# Altium schematic sheet ActiTouch_Transmitter_Sheet1.SchDoc
size A4; SheetNumber: 3; SheetTotal: 6
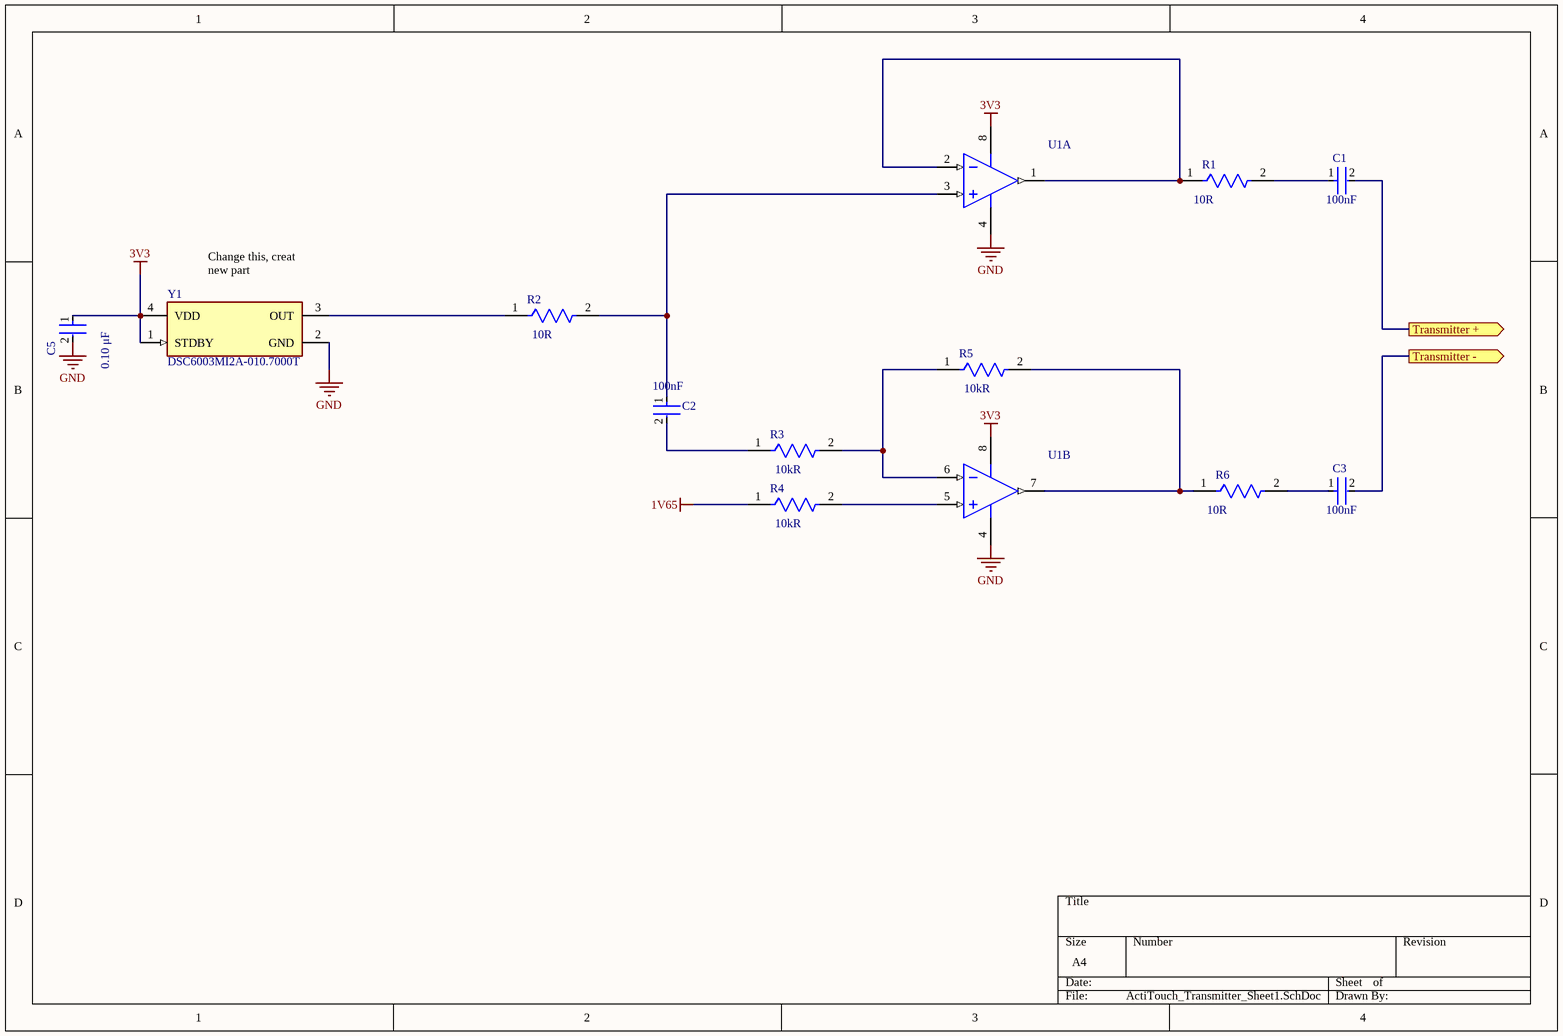
[diagram p0: ActiTouch_Transmitter_Sheet1.SchDoc]

## Parts
C1  Capacitance: 100nF  [FP-0603-L_1_6_0_1-W_0_8_0-IPC_B]  (hidden comment: EMK107B7104KAHT)
C2  Capacitance: 100nF  [FP-0603-L_1_6_0_1-W_0_8_0-IPC_B]  (hidden comment: EMK107B7104KAHT)
C3  Capacitance: 100nF  [FP-0603-L_1_6_0_1-W_0_8_0-IPC_B]  (hidden comment: EMK107B7104KAHT)
C5  value 0.10 μF  [FP-C0603C-CF-MFG]  (hidden comment: C0603C104K5RACTU)
R1  Resistance: 10R  [FP-RNCP0603-MFG]  (hidden comment: RNCP0603FTD10R0)
R2  Resistance: 10R  [FP-RNCP0603-MFG]  (hidden comment: RNCP0603FTD10R0)
R3  Resistance: 10kR  [FP-RNCP0603-MFG]  (hidden comment: RNCP0603FTD10R0)
R4  Resistance: 10kR  [FP-RNCP0603-MFG]  (hidden comment: RNCP0603FTD10R0)
R5  Resistance: 10kR  [FP-RNCP0603-MFG]  (hidden comment: RNCP0603FTD10R0)
R6  Resistance: 10R  [FP-RNCP0603-MFG]  (hidden comment: RNCP0603FTD10R0)
U1  OPA2836IDR  [D0008A_M]  (value not drawn)  (parts A,B of 2)
Y1  DSC6003MI2A-010.7000T  [FP-C04-1202-MFG]

## Ports
Transmitter + (out), Transmitter - (out)

## Nets
1V65: R4.1
3V3: C5.1 U1.8(VS+) Y1.1(STDBY) Y1.4(VDD)
GND: C5.2 U1.4(VS-) Y1.2(GND)
Transmitter +: C1.2 ; port Transmitter +
Transmitter -: C3.2 ; port Transmitter -
NetC1_1: C1.1 R1.2
NetC2_1: C2.1 R2.2 U1.3(VIN1+)
NetC2_2: C2.2 R3.1
NetC3_1: C3.1 R6.2
NetR1_1: R1.1 U1.1(VOUT1) U1.2(VIN1-)
NetR2_1: R2.1 Y1.3(OUT)
NetR3_2: R3.2 R5.1 U1.6(VIN2-)
NetR4_2: R4.2 U1.5(VIN2+)
NetR5_2: R5.2 R6.1 U1.7(VOUT2)

## Notes on the sheet
- (near Y1) Change this, creat new part

## Library data of the parts
C1-C3 = CMP-14477-003798-2: None; Voltage Rating (DC): 16V; Tolerance: 10%; Package Quantity: 4000; Packaging: Tape and Reel; Lead Free: Lead Free; Voltage Rating: 16V; Halogen Free: Halogen Free; Case/Package: 0603
C5 = CMP-2006-03061-2: CAP CER 0.1UF 50V X7R 0603; Manufacturer: KEMET; Tolerance: 0.1; Temperature Coefficient: 30ppm/°C; Material: Ceramic; Automotive Grade: Grade 1; Temperature: -55°C to +125°C; RoHS: TRUE; Temperature Range High: +125°C; Lead Free: Yes; Octopart: https://octopart.com/c0603c104k5ractu-kemet-139244; Digikey Description: CAP CER 0.1UF 50V X7R 0603; Category: Cap; Package: C0603C-CF; ComponentLink2Description: Datasheet; Temperature Range Low: -55°C; Device Class L1: Passive Components; Voltage Rating: 50 V; Automotive: Yes; Device Class L3: Ceramic Capacitors; ComponentLink2URL: https://api.kemet.com/component-edge/download/datasheet/C0603C100J5GACAUTO.pdf; Capacitance: 0.10 μF; Device Class L2: Capacitors; Manufacturer Part Number: C0603C104K5RACTU; Temperature Characteristic: X7R; Height: 0.87mm
R1-R6 = CMP-26527-000751-1: 10Ω ±1% 0.125W 0603 High Power Anti-Sulfur Thin Film Chip Resistor; Temperature Coefficient: 100ppm/°C; Max Power Dissipation: 125mW; Case Code (Imperial): 0603; Case/Package: 0603; Tolerance: 1%; Features: Moisture Resistant; Width: 0.031inch; Series: RNCP; Lead Free: Lead Free; Max Operating Temperature: 155°C; Height: 0.02inch; Length: 0.059inch; Case Code (Metric): 1608; Min Operating Temperature: -55°C; Packaging: Tape and Reel; Resistor Type: Thin Film; RoHS Compliant: Yes; Mount: Surface Mount; Number of Terminations: 2
U1 = CMP-0018-00293-2: Dual, Very Low Power, Rail to Rail Out, Negative Rail In, VFB Operational Amplifier, 2.5 to 5.5 V, -40 to 85 degC, 8-pin SOIC (D8), Green (RoHS & no Sb/Br); Manufacturer: Texas Instruments; Settling Time (0.1%)(Typ)(ns): 30; Iib(Max)(nA): 1000; Vio(Max)(mV): 0.4; Vs(Min)(V): 2.5; Vs(Max)(V): 5.5; Io(Typ)(mA): 50; Sub Family: High Output Current Amplifier (>=50mA), High Speed Amplifier (>=50MHz), Low Noise Amp (<=10nV/rtHz), Low Offset Voltage Amplifier (<=500uV), Low Supply Voltage Amplifier (<=2.7V); Vn at Flatband(Typ)(nV/rtHz): 4.6; Slew Rate(Typ)(V/us): 560; Number of Channels: 2; Iq per channel(Max)(mA): 1; BW @ Acl(MHz): 205; 3rd Harmonic(dBc): 105; 2nd Harmonic(dBc): 85; Mounting Technology: Surface Mount; ComponentLink3URL: http://www.ti.com/litv/pdf/msoi002j; ComponentLink1URL: http://www.ti.com/; DatasheetVersion: SLOS712D; Code_JEDEC: MS-012; PackageDescription: 8-Pin Plastic Small Outline, Body 4.9 x 3.9 mm, Pitch 1.27 mm; ComponentLink3Description: Package Specification; Eco-Plan: Green (RoHS & no Sb/Br); PackageReference: D0008A; PackageVersion: 4040047-3/M, 06/2011; PartNumber: OPA2836IDR; ComponentLink2Description: Datasheet; Acl, min stable gain(V/V): 1; ComponentLink1Description: Manufacturer URL; ComponentLink2URL: http://www.ti.com/general/docs/lit/getliterature.tsp?genericPartNumber=OPA2836&fileType=pdf
Y1 = CMP-06255-000006-1: Max Supply Current: 1.3mA; Frequency Stability: 50ppm; Frequency: 24MHz; Case/Package: SMD/SMT; Packaging: Tape and Reel; Min Operating Temperature: -40°C; Ratings: AEC-Q100; Mount: Surface Mount; Max Operating Temperature: 85°C